# EAGLE design PIR_MotionDetector (EAGLE 7.4.0)
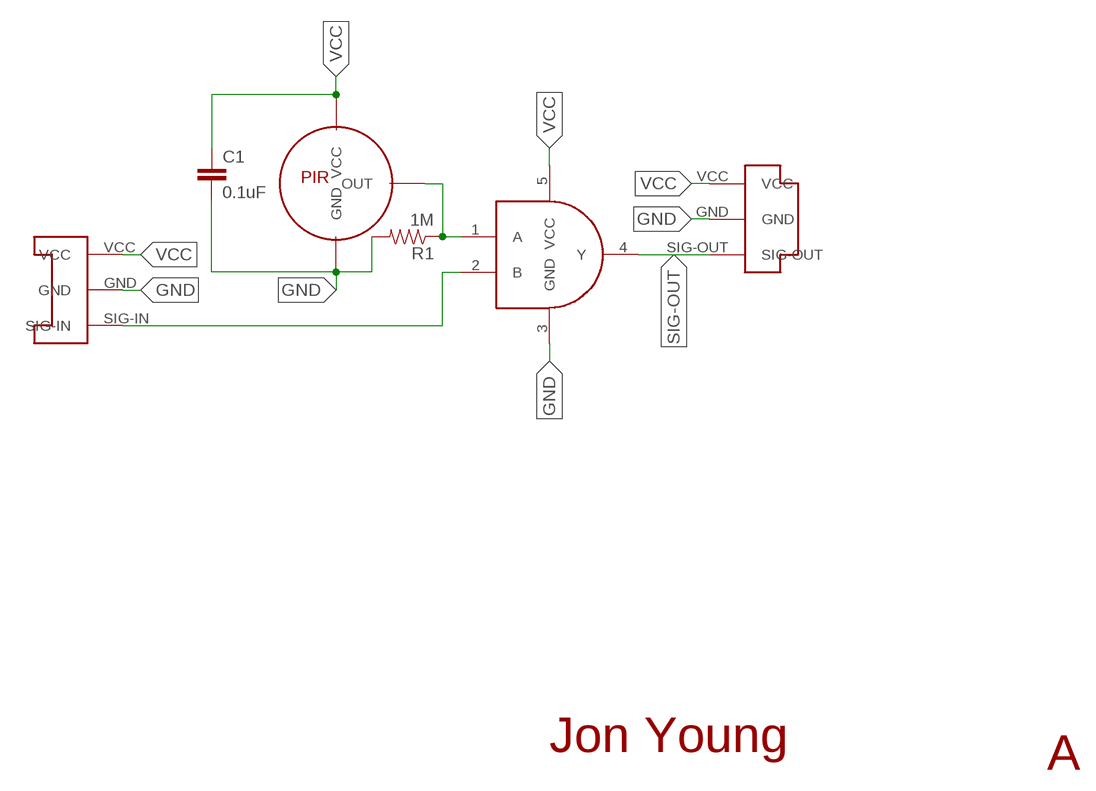
[diagram p0: schematic, sheet 1]

## Parts
C1  0.1uF  CAP0603-CAP  [0603-CAP]
R1  1M  1MOHM-1/10W-1%(0603)  [0603-RES]
U$1  CONN-PLUG-3POS-3MM  [PLUG-3POS-3MM-SMD]
U$2  CONN-SOCKET-3POS-3MM  [SOCKET-3POS-3MM-SMD]
U$3  PIR-PANASONIC-WL  [TO-5-3PIN]
U$4  AND-NC7SZ08  [SC70]

## Nets
GND: C1.2 R1.2 U$1.GND U$2.GND U$3.GND U$4.3(GND)
N$5: R1.1 U$3.OUT U$4.1(A)
SIG-IN: U$2.SIG-IN U$4.2(B)
SIG-OUT: U$1.SIG-OUT U$4.4(Y)
VCC: C1.1 U$1.VCC U$2.VCC U$3.VCC U$4.5(VCC)

## Notes on the sheet
- Jon Young
- A

## Library data of the parts
C1 = SparkFun-Passives:CAP: Capacitor Standard 0603 ceramic capacitor, and 0.1" leaded capacitor.
R1 = SparkFun-Resistors:1MOHM-1/10W-1%(0603): RES-07868; PROD_ID: RES-07868
U$1 = EmbeddedPlayground:CONN-PLUG-3POS-3MM: Surface mount board to board connector. Female socket, 3 position.
U$2 = EmbeddedPlayground:CONN-SOCKET-3POS-3MM: Surface mount board to board connector. Female socket, 3 position.
U$3 = EmbeddedPlayground:PIR-PANASONIC-WL
U$4 = EmbeddedPlayground:AND-NC7SZ08

## Board
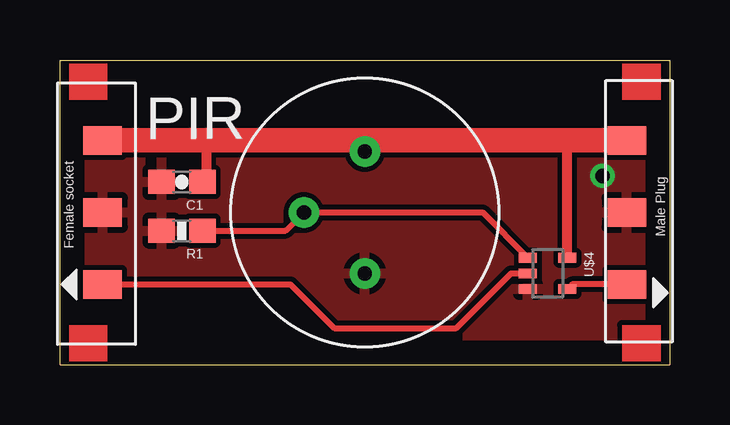
[diagram p1: board, top side]
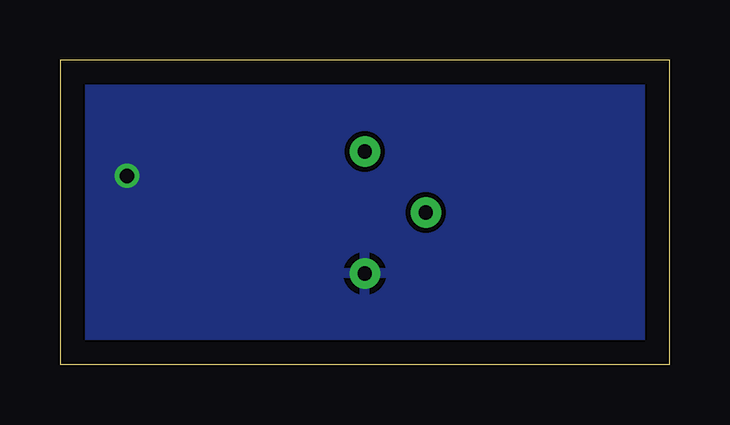
[diagram p2: board, bottom side, seen from below]

Size 25.4 x 12.7 mm. Coordinates in mm from the lower left corner, seen from the top.
Outline: 0,0 25.4,0 25.4,12.7 0,12.7 0,0
Copper layers (1*16): Top 0.035mm / dielectric 1.5mm / Bottom 0.035mm
Design rules "default": minimum track width 10mil, minimum drill 24mil, track to track 8mil, track to pad 8mil, pad to pad 8mil, via to via 8mil, smd to smd 8mil, copper to edge 40mil, drill to drill 8mil, minimum pad ring 10mil, minimum via ring 8mil, stop-mask expansion 4mil, vias tented up to drill 0mil, thermal gap 10mil

### Footprints (pad centres in the part's own frame; a part is rotated, then mirrored left to right if it is on the bottom)
0603-CAP = smd 1.1 x 1: 1 -0.85,0; 2 0.85,0
0603-RES = smd 1.1 x 1: 1 -0.85,0; 2 0.85,0
PLUG-3POS-3MM-SMD = smd 1.2 x 1.6: GND 0,0; SIG-OUT 3,0; VCC -3,0
SOCKET-3POS-3MM-SMD = smd 1.2 x 1.6: GND 0,0; SIG-IN -3,0; VCC 3,0
TO-5-3PIN = drill 0.6 pad 1.27: GND 0,2.54; OUT 2.54,0; VCC 0,-2.54
SC70 = smd 0.4 x 0.75: 1 -0.65,-0.825; 2 0,-0.825; 3 0.65,-0.825; 4 0.65,0.825; 5 -0.65,0.825

### Placement (x,y rotation side)
C1  5.08,7.62 180 top
R1  5.08,5.59 180 top
U$1  23.62,6.35 270 top
U$2  1.78,6.35 90 top
U$3  12.7,6.35 180 top
U$4  20.32,3.81 270 top

### Tracks (layer width: path | path; a pad name or v marks a point on that pad's centre or on a via)
GND  (via drill 0.6)
  other vias: 22.61,7.87
  pour Top: -1.27,13.91 -1.27,-1.27 30.39,-1.27 30.39,13.91
  pour Bottom: -1.27,13.91 32.93,13.91 32.93,-1.27 -1.27,-1.27
N$5
  Top 0.254: U$4.1 17.61,6.35 U$3.OUT 9.4,5.59 R1.1
SIG-IN
  Top 0.254: U$2.SIG-IN 9.6,3.35 11.43,1.52 16.51,1.52 18.8,3.81 U$4.2
SIG-OUT
  Top 0.254: U$1.SIG-OUT 21.34,3.35 U$4.4
VCC
  Top 0.406: U$2.VCC 5.89,9.35 6.1,9.14 | 6.1,9.14 6.1,7.79 C1.1 | 6.1,9.14 12.45,9.14 U$3.VCC | U$4.5 21.14,9.29 21.08,9.35
  Top 1.016: U$2.VCC 21.08,9.35 U$1.VCC

### Text on the board
tPlace: PIR